# Altium schematic sheet Volt Regulator.SchDoc
size A4; SheetNumber: 1; SheetTotal: 1
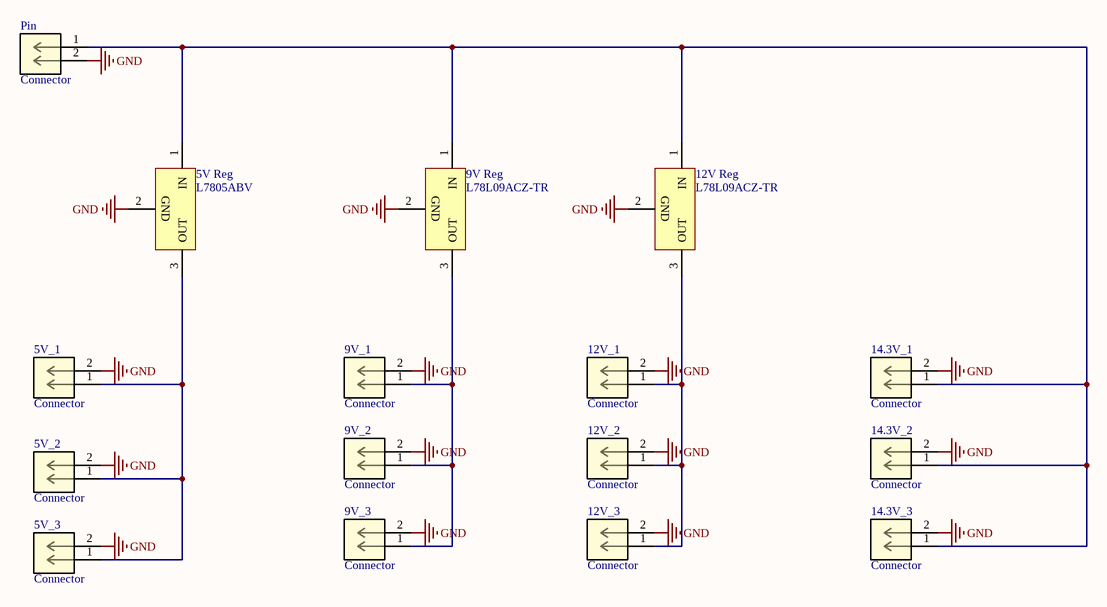
[diagram p0: Volt Regulator.SchDoc]

## Parts
5V_1  Connector  [CONN_B2B-XH-A_JST]
5V_2  Connector  [CONN_B2B-XH-A_JST]
5V_3  Connector  [CONN_B2B-XH-A_JST]
5V_Reg  L7805ABV  [TO220]
9V_1  Connector  [CONN_B2B-XH-A_JST]
9V_2  Connector  [CONN_B2B-XH-A_JST]
9V_3  Connector  [CONN_B2B-XH-A_JST]
9V_Reg  L78L09ACZ-TR  [TO220]
12V_1  Connector  [CONN_B2B-XH-A_JST]
12V_2  Connector  [CONN_B2B-XH-A_JST]
12V_3  Connector  [CONN_B2B-XH-A_JST]
12V_Reg  L78L09ACZ-TR  [TO220]
14.3V_1  Connector  [CONN_B2B-XH-A_JST]
14.3V_2  Connector  [CONN_B2B-XH-A_JST]
14.3V_3  Connector  [CONN_B2B-XH-A_JST]
Pin  Connector  [CONN_B2B-XH-A_JST]

## Nets
GND: 5V_1.2 5V_2.2 5V_3.2 5V_Reg.2(GND) 9V_1.2 9V_2.2 9V_3.2 9V_Reg.2(GND) 12V_1.2 12V_2.2 12V_3.2 12V_Reg.2(GND) 14.3V_1.2 14.3V_2.2 14.3V_3.2 Pin.2
Net5V_1_1: 5V_1.1 5V_2.1 5V_3.1 5V_Reg.3(OUT)
Net5V_Reg_1: 5V_Reg.1(IN) 9V_Reg.1(IN) 12V_Reg.1(IN) 14.3V_1.1 14.3V_2.1 14.3V_3.1 Pin.1
Net9V_1_1: 9V_1.1 9V_2.1 9V_3.1 9V_Reg.3(OUT)
Net12V_1_1: 12V_1.1 12V_2.1 12V_3.1 12V_Reg.3(OUT)

## Library data of the parts
5V_1-5V_3 9V_1-9V_3 12V_1-12V_3 14.3V_1-14.3V_3 Pin = B2B-XH-A: Header B2B-XH-A, 2.50mm, 2-contacts, top entry, THT /1000/box; Manufacturer: JST; Supplier: Digikey; Supplier Part Number: 455-B2B-XH-A-ND; Manufacturer Part Number: B2B-XH-A; RoHS: Yes; Category: FFC / FPC; Stock: 990478; Pricing: 1=0.15, 10=0.122, 100=0.0898, 500=0.07432, 1000=0.06502, 5000=0.05573, 10000=0.05419 (USD); ComponentLink1URL: https://www.distrelec.biz/Web/Downloads/_t/ds/xh-series_eng_tds.pdf?mime=application%2Fpdf&src-supplier=Distrelec; ComponentLink1Description: https://www.distrelec.biz/Web/Downloads/_t/ds/xh-series_eng_tds.pdf?mime=application%2Fpdf&src-supplier=Distrelec
5V_Reg = L7805ABV: Fixed Positive Standard Regulator, 5VBIPolar, PSFM3; Manufacturer: STMicroelectronics; Dropout Voltage1-Nom: 2V; Input Voltage Absolute-Max: 35V; Max Supply Voltage: 25V; Min Input Voltage: 7.5V; Line Regulation-Max: 0.05%; Load Regulation-Max: 0.1%; Channels: 1; Output Current1-Max: 1.5A; Output Voltage1-Max: 5.2V; Output Voltage1-Min: 4.8V; Output Voltage1-Nom: 5V; Package Equivalence Code: SIP3,.1TB; Regulator Type: FIXED POSITIVE SINGLE OUTPUT STANDARD REGULATOR; Surface Mount: No; Voltage Tolerance-Max: 4%; Qualification Status: Not Qualified; Supplier: Digikey; Supplier Part Number: 497-2947-5-ND; Manufacturer Part Number: L7805ABV; RoHS: Yes; Category: Voltage Regulators - Linear; Stock: 5456; Pricing: 1=0.74, 10=0.648, 50=0.6086, 100=0.4968, 250=0.4614, 500=0.39268, 1000=0.31415, 2500=0.2847, 5000=0.26506 (USD); Case/Package: TO-220; Pins: 3; Package Shape: Rectangular; Terminal Finish: Tin; JESD-609 Code: e3; Adjustability: FIXED; Number of Outputs: 1; Operating Temperature, TJ-Max: 125°C; Operating Temperature, TJ-Min: -40°C; Package Style: FLANGE MOUNTMeter; Technology: BIPOLAR; Terminal Form: Through Hole; Terminal Position: SINGLE; Terminal Pitch: 2.54mm; RoHS Compliant: Yes; Reach SVHC Compliant: No; ComponentLink1URL: https://datasheet.ciiva.com:443/pdfs/VipMasterIC/IC/SGST/SGST-S-A0006334694/SGST-S-A0006334694-1.pdf?src-supplier=IHS+Markit; ComponentLink1Description: https://datasheet.ciiva.com:443/pdfs/VipMasterIC/IC/SGST/SGST-S-A0006334694/SGST-S-A0006334694-1.pdf?src-supplier=IHS+Markit; ComponentLink2URL: https://datasheet.ciiva.com/15111/getdatasheetpartid-87002-15111517.pdf?src-supplier=Verical; ComponentLink2Description: https://datasheet.ciiva.com/15111/getdatasheetpartid-87002-15111517.pdf?src-supplier=Verical; ComponentLink3URL: https://datasheet.ciiva.com/1511/1805459-1511907.pdf?src-supplier=Element14; ComponentLink3Description: https://datasheet.ciiva.com/1511/1805459-1511907.pdf?src-supplier=Element14; ComponentLink4URL: https://datasheet.ciiva.com/1512/1696820-1512331.pdf?src-supplier=Element14; ComponentLink4Description: https://datasheet.ciiva.com/1512/1696820-1512331.pdf?src-supplier=Element14
9V_Reg 12V_Reg = L78L09ACZ-TR: Fixed Positive Standard Regulator, 9VBIPolar; Manufacturer: STMicroelectronics; Dropout Voltage1-Nom: 1.7V; Input Voltage Absolute-Max: 30V; Max Supply Voltage: 23V; Min Input Voltage: 11.5V; Line Regulation-Max: 0.225%; Load Regulation-Max: 0.08%; Channels: 1; Output Current1-Max: 70mA; Output Voltage1-Max: 9.45V; Output Voltage1-Min: 8.55V; Output Voltage1-Nom: 9V; Package Equivalence Code: SIP3,.1,50; Regulator Type: FIXED POSITIVE SINGLE OUTPUT STANDARD REGULATOR; Surface Mount: No; Voltage Tolerance-Max: 5%; Qualification Status: Not Qualified; Supplier: Digikey; Supplier Part Number: 497-15651-1-ND; Manufacturer Part Number: L78L09ACZ-TR; RoHS: Yes; Category: Voltage Regulators - Linear; Stock: 15716; Pricing: 1=0.34, 10=0.274, 25=0.2504, 100=0.1863, 250=0.16888, 500=0.13976, 1000=0.10482 (USD); Case/Package: TO-92; Pins: 3; Package Shape: Round; Terminal Finish: Tin; JESD-609 Code: e3; Adjustability: FIXED; Number of Outputs: 1; Operating Temperature, TJ-Max: 125°C; Operating Temperature, TJ-Min: 0°C; Package Style: CYLINDRICALMeter; Packaging: Tape and Reel; Technology: BIPOLAR; Terminal Form: Through Hole; Terminal Position: BOTTOM; Terminal Pitch: 1.27mm; Reach SVHC Compliant: Yes; RoHS Compliant: Yes; ComponentLink1URL: https://datasheet.ciiva.com:443/pdfs/VipMasterIC/IC/SGST/SGST-S-A0002857926/SGST-S-A0002857926-1.pdf?src-supplier=IHS+Markit; ComponentLink1Description: https://datasheet.ciiva.com:443/pdfs/VipMasterIC/IC/SGST/SGST-S-A0002857926/SGST-S-A0002857926-1.pdf?src-supplier=IHS+Markit; ComponentLink2URL: https://datasheet.ciiva.com/2060/cd00000446-2060086.pdf?src-supplier=Digikey; ComponentLink2Description: https://datasheet.ciiva.com/2060/cd00000446-2060086.pdf?src-supplier=Digikey; ComponentLink3URL: https://datasheet.ciiva.com/4883/cd00000446-4883326.pdf?src-supplier=Mouser; ComponentLink3Description: https://datasheet.ciiva.com/4883/cd00000446-4883326.pdf?src-supplier=Mouser; ComponentLink4URL: https://datasheet.ciiva.com/16443/cd00000446-16443420.pdf?src-supplier=Future+Electronics; ComponentLink4Description: https://datasheet.ciiva.com/16443/cd00000446-16443420.pdf?src-supplier=Future+Electronics